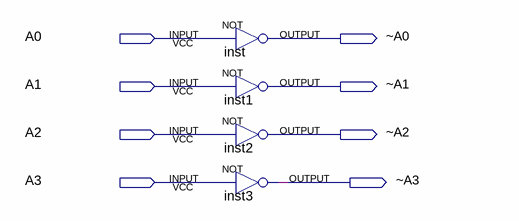
[diagram p0: schematic sheet]
// Quartus schematic bitwiseNOT.bdf as structural Verilog: 4 symbols, 8 pins
module bitwiseNOT (
  input  A0,
  input  A1,
  input  A2,
  input  A3,
  output \~A0 ,
  output \~A1 ,
  output \~A2 ,
  output \~A3 
);

  not inst (\~A0 , A0);
  not inst1 (\~A1 , A1);
  not inst2 (\~A2 , A2);
  not inst3 (\~A3 , A3);
endmodule
